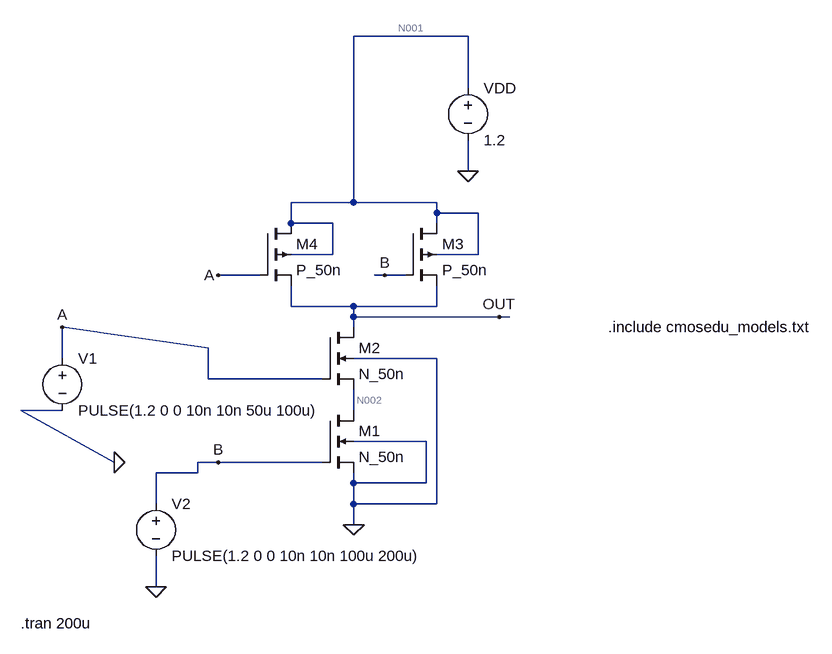
[diagram p0: schematic AND 2 entradas.asc]
AND 2 entradas.asc, the LTspice schematic file:
Version 4
SHEET 1 936 680
WIRE 384 -368 208 -368
WIRE 384 -288 384 -368
WIRE 384 -160 384 -208
WIRE 208 -112 208 -368
WIRE 208 -112 112 -112
WIRE 336 -112 208 -112
WIRE 336 -96 336 -112
WIRE 400 -96 336 -96
WIRE 112 -80 112 -112
WIRE 176 -80 112 -80
WIRE 336 -80 336 -96
WIRE 176 -32 176 -80
WIRE 176 -32 112 -32
WIRE 400 -32 400 -96
WIRE 400 -32 336 -32
WIRE 64 0 0 0
WIRE 256 0 240 0
WIRE 288 0 256 0
WIRE 112 48 112 16
WIRE 208 48 112 48
WIRE 336 48 336 16
WIRE 336 48 208 48
WIRE 208 64 208 48
WIRE 432 64 208 64
WIRE 448 64 432 64
WIRE 208 80 208 64
WIRE -16 112 -240 80
WIRE -240 128 -240 80
WIRE 336 128 208 128
WIRE -16 160 -16 112
WIRE 160 160 -16 160
WIRE -240 208 -304 208
WIRE 208 208 208 176
WIRE 320 256 208 256
WIRE -160 288 -304 208
WIRE 0 288 -32 288
WIRE 160 288 0 288
WIRE -32 304 -32 288
WIRE -32 304 -96 304
WIRE 208 320 208 304
WIRE 320 320 320 256
WIRE 320 320 208 320
WIRE -96 352 -96 304
WIRE 208 352 208 320
WIRE 336 352 336 128
WIRE 336 352 208 352
WIRE 208 384 208 352
WIRE -96 480 -96 432
FLAG -160 288 0
FLAG -96 480 0
FLAG 384 -160 0
FLAG -240 80 A
FLAG 0 288 B
FLAG 208 384 0
FLAG 432 64 OUT
FLAG 0 0 A
FLAG 256 0 B
SYMBOL nmos4 160 208 R0
SYMATTR InstName M1
SYMATTR Value N_50n
SYMATTR Value2 l=50n w=0.5u
SYMBOL nmos4 160 80 R0
SYMATTR InstName M2
SYMATTR Value N_50n
SYMATTR Value2 l=50n w=0.5u
SYMBOL pmos4 288 -80 R0
SYMATTR InstName M3
SYMATTR Value P_50n
SYMATTR Value2 l=50n w=1.12u
SYMBOL pmos4 64 -80 R0
SYMATTR InstName M4
SYMATTR Value P_50n
SYMATTR Value2 l=50n w=1.12u
SYMBOL voltage -240 112 R0
WINDOW 123 0 0 Left 2
WINDOW 39 0 0 Left 2
SYMATTR InstName V1
SYMATTR Value PULSE(1.2 0 0 10n 10n 50u 100u)
SYMBOL voltage -96 336 R0
WINDOW 123 0 0 Left 2
WINDOW 39 0 0 Left 2
SYMATTR InstName V2
SYMATTR Value PULSE(1.2 0 0 10n 10n 100u 200u)
SYMBOL voltage 384 -304 R0
WINDOW 123 0 0 Left 2
WINDOW 39 0 0 Left 2
SYMATTR InstName VDD
SYMATTR Value 1.2
TEXT 600 80 Left 2 !.include cmosedu_models.txt
TEXT -304 536 Left 2 !.tran 200u

The netlist it stands for:
* AND 2 entradas.asc
M1 N002 B 0 0 N_50n l=50n w=0.5u
M2 OUT A N002 0 N_50n l=50n w=0.5u
M3 N001 B OUT N001 P_50n l=50n w=1.12u
M4 N001 A OUT N001 P_50n l=50n w=1.12u
V1 A 0 PULSE(1.2 0 0 10n 10n 50u 100u)
V2 B 0 PULSE(1.2 0 0 10n 10n 100u 200u)
VDD N001 0 1.2
.model NMOS NMOS
.model PMOS PMOS
.lib standard.mos
.include cmosedu_models.txt
.tran 200u
.backanno
.end

* Results of the author's LTspice run, read from the files saved beside the schematic
* Operating Point, zero values left out:
*   V(n002) = 81.34 µV
*   V(b) = 1.2 V
*   V(out) = 158.2 µV
*   V(a) = 1.2 V
*   V(n001) = 1.2 V
*   Id(M4) = 10.5 nA
*   Ig(M4) = 26.39 nA
*   Ib(M4) = 6.98 pA
*   Is(M4) = -36.89 nA
*   Id(M3) = 10.5 nA
*   Ig(M3) = 26.39 nA
*   Ib(M3) = 6.98 pA
*   Is(M3) = -36.89 nA
*   Id(M2) = 73.78 nA
*   Ig(M2) = 5.147 nA
*   Ib(M2) = -713.6 pA
*   Is(M2) = -78.21 nA
*   Id(M1) = 78.21 nA
*   Ig(M1) = 5.149 nA
*   Ib(M1) = -714.3 pA
*   Is(M1) = -82.64 nA
*   I(Vdd) = -21.01 nA
*   I(V2) = -31.53 nA
*   I(V1) = -31.53 nA
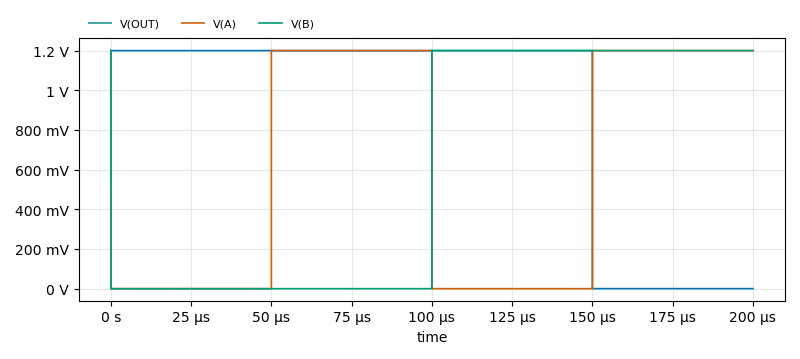
[diagram p1: Transient Analysis of AND 2 entradas.asc, plotted from the saved traces]
* Transient Analysis, 1 run:
*   V(OUT): min -657.1 µV, max 1.201 V, average 900.1 mV, rms 1.039 V, last 159.3 µV
*   V(A): min 0 V, max 1.2 V, average 599.9 mV, rms 848.4 mV, last 1.2 V
*   V(B): min 0 V, max 1.2 V, average 599.9 mV, rms 848.5 mV, last 1.2 V